# EAGLE schematic supply-wired (EAGLE 9.6.2)
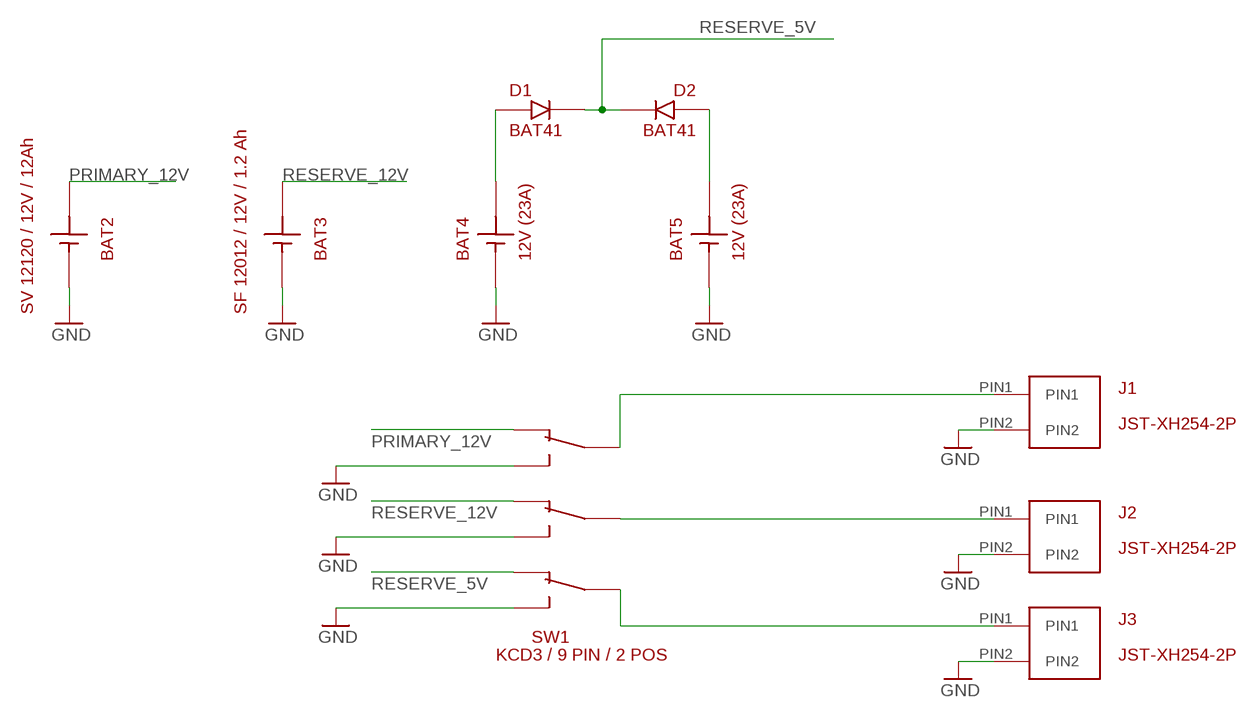
[diagram p0: schematic, sheet 1]

## Parts
BAT2  SV 12120 / 12V / 12Ah  BATTERY  [BATTERY]
BAT3  SF 12012 / 12V / 1.2 Ah  BATTERY  [BATTERY]
BAT4  12V (23A)  BATTERY  [BATTERY]
BAT5  12V (23A)  BATTERY  [BATTERY]
D1  BAT41  D  [D]
D2  BAT41  D  [D]
J1  JST-XH254-2P  [JST-XH254-2P]
J2  JST-XH254-2P  [JST-XH254-2P]
J3  JST-XH254-2P  [JST-XH254-2P]
SW1  KCD3 / 9 PIN / 2 POS  SWITCH_3_2  [SWITCH_3_2]

## Nets
GND: J1.PIN2 J2.PIN2 J3.PIN2 SW1.IN_1_2 SW1.IN_2_2 SW1.IN_3_2
MINUS: BAT2.MINUS BAT3.MINUS BAT4.MINUS BAT5.MINUS ; supply symbol labelled GND
N$1: J1.PIN1 SW1.OUT_1
N$2: J2.PIN1 SW1.OUT_2
N$3: J3.PIN1 SW1.OUT_3
PLUS: BAT4.PLUS BAT5.PLUS D1.P$1(ANODE) D2.P$1(ANODE)
PRIMARY_12V: BAT2.PLUS SW1.IN_1_1
RESERVE_5V: D1.P$2(CATHODE) D2.P$2(CATHODE) SW1.IN_3_1
RESERVE_12V: BAT3.PLUS SW1.IN_2_1

## Library data of the parts
BAT2-BAT5 = my_devices:BATTERY
D1 D2 = my_devices:D
J1-J3 = my_devices:JST-XH254-2P
SW1 = my_devices:SWITCH_3_2